# EAGLE schematic photocell (EAGLE 6.5.0)
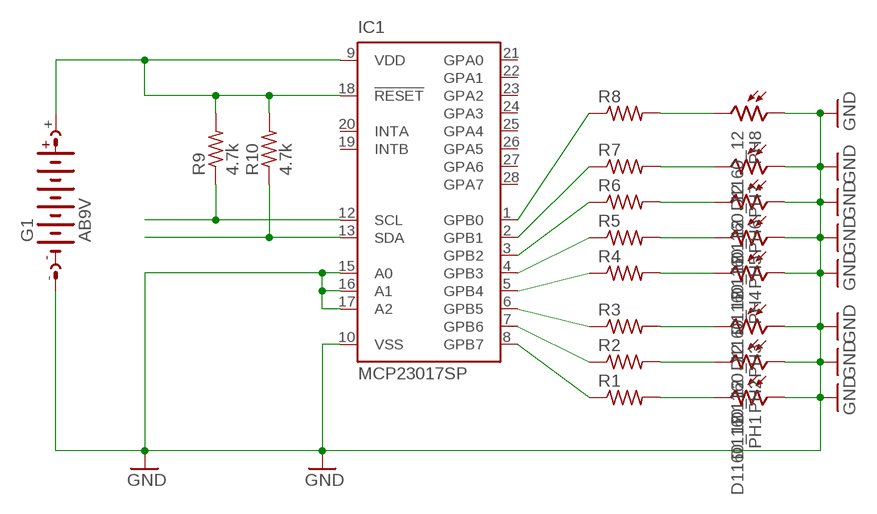
[diagram p0: schematic, sheet 1]

## Parts
G1  AB9V  [AB9V]
IC1  MCP23017SP  [DIL28-3]
PH1  D1160_12  [D11XX]
PH2  D1160_12  [D11XX]
PH3  D1160_12  [D11XX]
PH4  D1160_12  [D11XX]
PH5  D1160_12  [D11XX]
PH6  D1160_12  [D11XX]
PH7  D1160_12  [D11XX]
PH8  D1160_12  [D11XX]
R1  R-US_0204/7  [0204/7]
R2  R-US_0204/7  [0204/7]
R3  R-US_0204/7  [0204/7]
R4  R-US_0204/7  [0204/7]
R5  R-US_0204/7  [0204/7]
R6  R-US_0204/7  [0204/7]
R7  R-US_0204/7  [0204/7]
R8  R-US_0204/7  [0204/7]
R9  4.7k  R-US_0204/7  [0204/7]
R10  4.7k  R-US_0204/7  [0204/7]

## Nets
GND: G1.- IC1.10(VSS) IC1.15(A0) IC1.16(A1) IC1.17(A2) PH1.1 PH2.1 PH3.1 PH4.1 PH5.1 PH6.1 PH7.1 PH8.1
N$1: IC1.8(GPB7) R1.1
N$2: IC1.7(GPB6) R2.1
N$3: IC1.6(GPB5) R3.1
N$4: IC1.5(GPB4) R4.1
N$5: IC1.4(GPB3) R5.1
N$6: IC1.3(GPB2) R6.1
N$7: IC1.2(GPB1) R7.1
N$8: IC1.1(GPB0) R8.1
N$9: PH1.2 R1.2
N$10: PH2.2 R2.2
N$11: PH3.2 R3.2
N$12: PH4.2 R4.2
N$13: PH5.2 R5.2
N$14: PH6.2 R6.2
N$15: PH7.2 R7.2
N$16: PH8.2 R8.2
N$17: G1.+ IC1.9(VDD) IC1.18(!RESET) R9.2 R10.2
N$18: IC1.12(SCL) R9.1
N$19: IC1.13(SDA) R10.1
Unconnected: IC1.19(INTB) IC1.20(INTA) IC1.21(GPA0) IC1.22(GPA1) IC1.23(GPA2) IC1.24(GPA3) IC1.25(GPA4) IC1.26(GPA5) IC1.27(GPA6) IC1.28(GPA7)

## Library data of the parts
G1 = battery:AB9V: 9-V BATTERY CLIP
IC1 = microchip:MCP23017: http://ww1.microchip.com/downloads/en/DeviceDoc/21952a.pdf Source: http://ww1.microchip.com/downloads/en/DeviceDoc/21952a.pdf; MF: MICROCHIP; MPN: MCP23017-E/SP; OC_FARNELL: 1332088; OC_NEWARK: 31K2959
PH1-PH8 = photo-elements:D11: Photo Sensor Oil Burner Control Applications Source: http://optoelectronics.perkinelmer.com/content/Datasheets/DTS_PhotocellsD1160.pdf
R1-R10 = resistor:R-US_: RESISTOR, American symbol

## Net classes
0 default: width 0.305 mm, drill 0.508 mm, clearance 0.254 mm